# EAGLE schematic plugV13 (EAGLE 7.5.0)
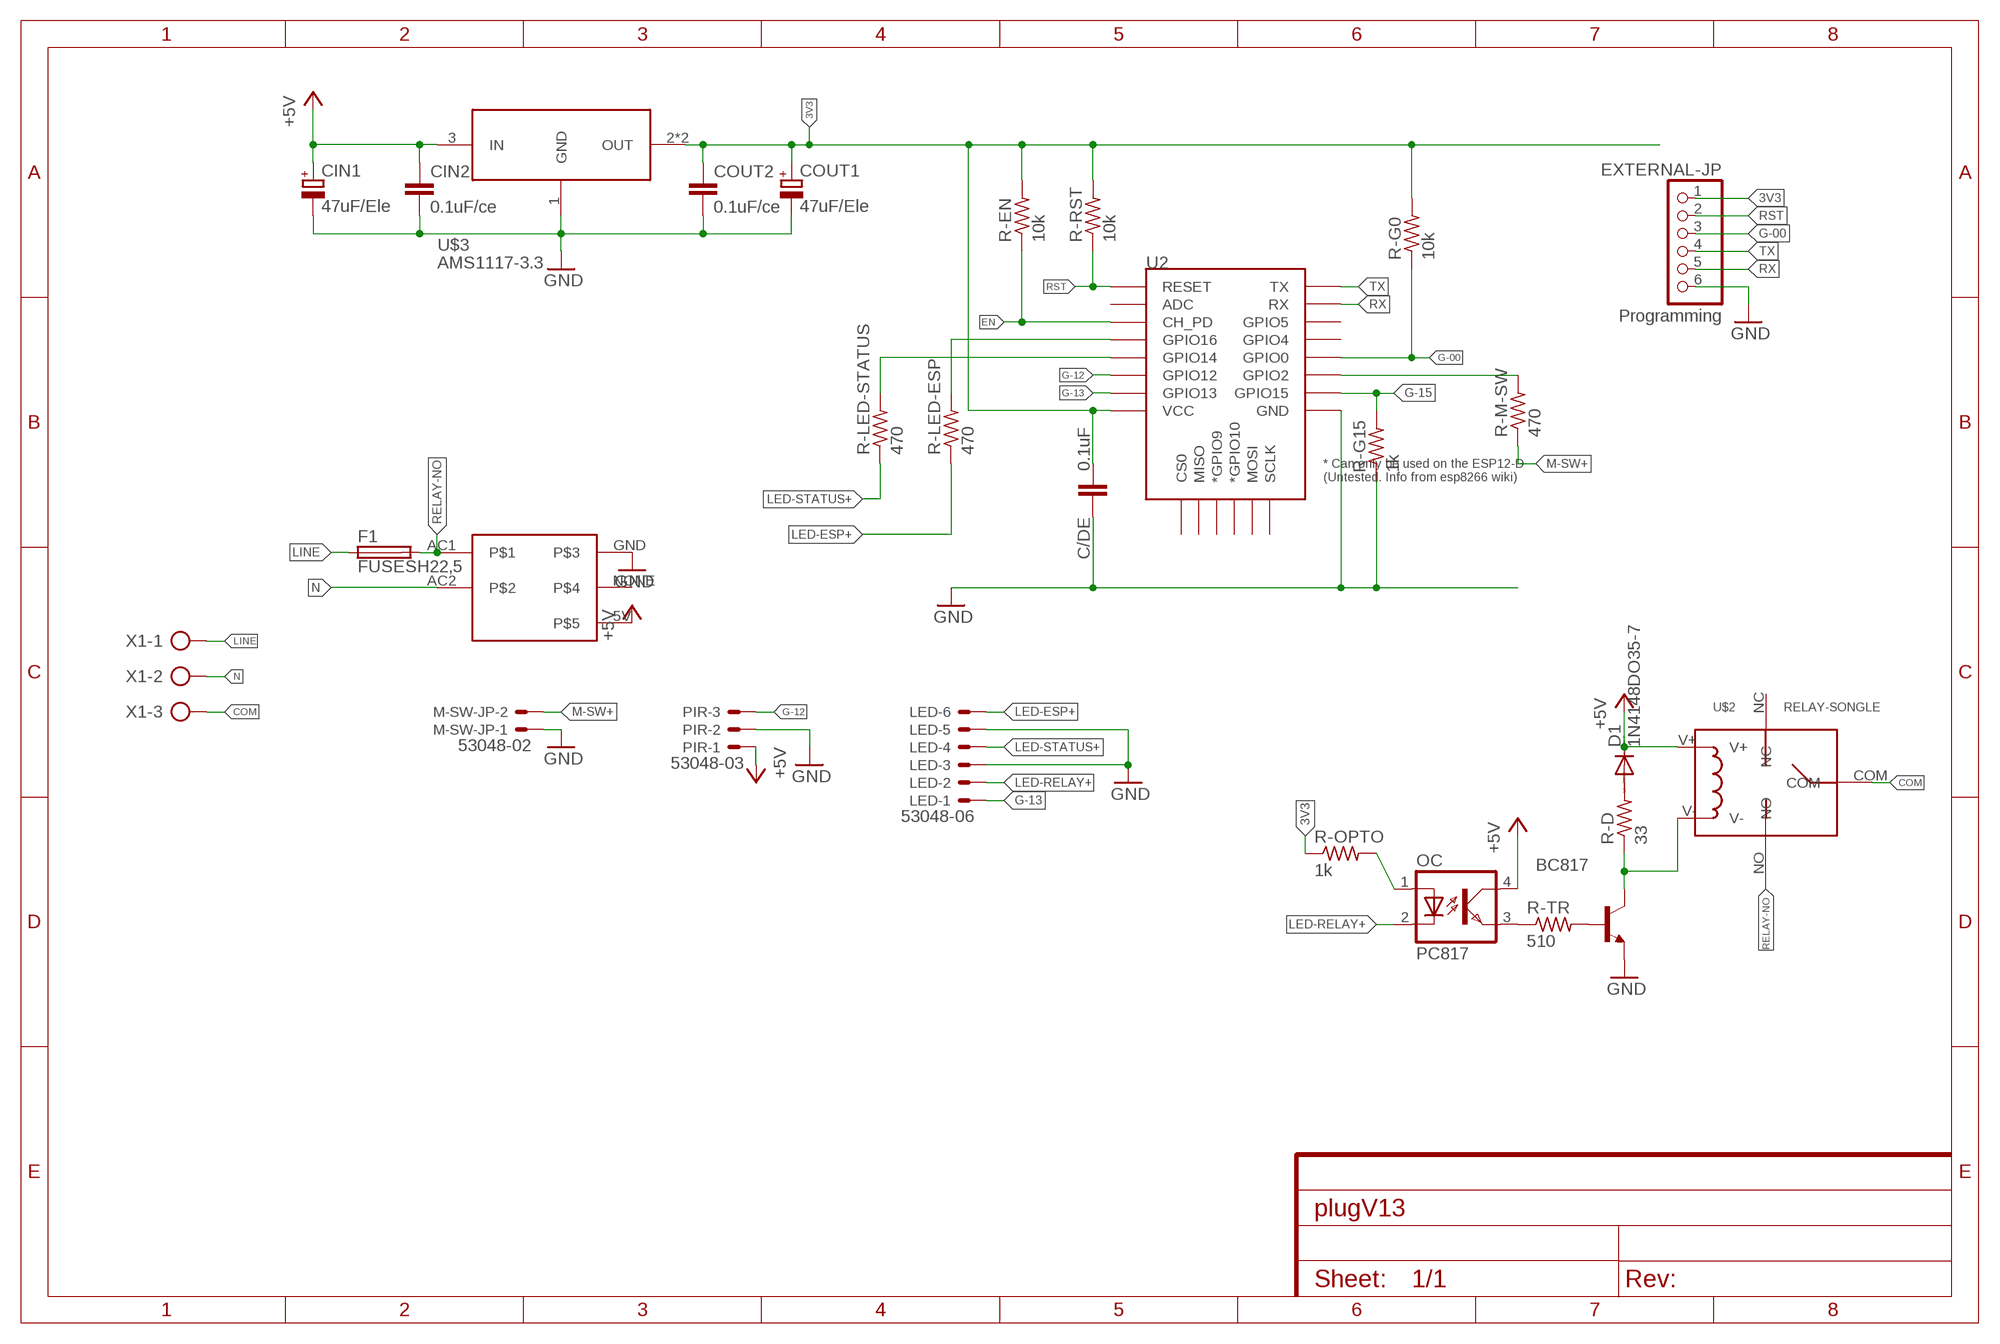
[diagram p0: schematic, sheet 1]

## Parts
BC817  BC817-NPN-SOT23-BEC  [SOT23-BEC]
C/DE  0.1uF  C-EUC0805  [C0805]
CIN1  47uF/Ele  CPOL-EUE2-5  [E2-5]
CIN2  0.1uF/ce  C-EUC0603K  [C0603K]
COUT1  47uF/Ele  CPOL-EUE2-5  [E2-5]
COUT2  0.1uF/ce  C-EUC0603K  [C0603K]
D1  1N4148DO35-7  [DO35-7]
EXTERNAL-JP  Programming  PINHD-1X6  [1X06]
F1  FUSESH22,5  [SH22,5]
LED  53048-06  [53048-06]
M-SW-JP  53048-02  [53048-02]
OC  PC817  [DIL04]
PIR  53048-03  [53048-03]
R-D  33  R-US_M0805  [M0805]
R-EN  10k  R-US_R0603  [R0603]
R-G0  10k  R-US_R0603  [R0603]
R-G15  1k  R-US_R0603  [R0603]
R-LED-ESP  470  R-US_R0603  [R0603]
R-LED-STATUS  470  R-US_R0603  [R0603]
R-M-SW  470  R-US_R0603  [R0603]
R-OPTO  1k  R-US_M0805  [M0805]
R-RST  10k  R-US_R0603  [R0603]
R-TR  510  R-US_M0805  [M0805]
U2  ESP12ESMD  [ESP12E-SMD]
U$2  RELAY-SONGLE  [RELAY-SONGLE]
U$3  AMS1117-3.3  [SOT-223]
U$4  POWERSUPPLY-5V-700MA  [POWERSUPPLY-5V-700MA]
X1  AK300/3  [AK300/3]

## Nets
3V3: C/DE.1 COUT1.+ COUT2.1 EXTERNAL-JP.1 R-EN.2 R-G0.2 R-OPTO.1 R-RST.2 U2.VCC U$3.2(OUT) U$3.4(OUT)
+5V: CIN1.+ CIN2.1 D1.C OC.4(COL) PIR.1 U$2.V+ U$3.3(IN) U$4.5V
COM: U$2.COM X1.3
EN: R-EN.1 U2.CH_PD
G-00: EXTERNAL-JP.3 R-G0.1 U2.GPIO0
G-12: PIR.3 U2.GPIO12
G-13: LED.1 U2.GPIO13
G-15: R-G15.2 U2.GPIO15
GND: BC817.E C/DE.2 CIN1.- CIN2.2 COUT1.- COUT2.2 EXTERNAL-JP.6 LED.3 LED.5 M-SW-JP.1 PIR.2 R-G15.1 U2.GND U$3.1(GND) U$4.GND
LED-ESP+: LED.6 R-LED-ESP.1
LED-RELAY+: LED.2 OC.2(C)
LED-STATUS+: LED.4 R-LED-STATUS.1
LINE: F1.1 X1.1
M-SW+: M-SW-JP.2 R-M-SW.1
N: U$4.AC2 X1.2
N$1: OC.3(EMIT) R-TR.1
N$2: BC817.B R-TR.2
N$4: R-LED-ESP.2 U2.GPIO16
N$7: R-M-SW.2 U2.GPIO2
N$8: R-LED-STATUS.2 U2.GPIO14
N$13: OC.1(A) R-OPTO.2
N$16: D1.A R-D.2
N$17: BC817.C R-D.1 U$2.V-
RELAY-NO: F1.2 U$2.NO U$4.AC1
RST: EXTERNAL-JP.2 R-RST.1 U2.RESET
RX: EXTERNAL-JP.5 U2.RXD0(RX)
TX: EXTERNAL-JP.4 U2.TXD0(TX)
Unconnected: U2.ADC U2.CS0 U2.GPIO4 U2.GPIO5 U2.GPIO9(*GPIO9) U2.GPIO10(*GPIO10) U2.MISO U2.MOSI U2.SCLK U$2.NC U$4.NONE

## Library data of the parts
BC817 = transistor-neu-to92:*-NPN-: NPN Transistror
C/DE CIN2 COUT2 = rcl:C-EU: CAPACITOR, European symbol
CIN1 COUT1 = rcl:CPOL-EU: POLARIZED CAPACITOR, European symbol
D1 = diode:1N4148: DIODE high speed (Philips)
EXTERNAL-JP = pinhead:PINHD-1X6: PIN HEADER
F1 = fuse:FUSE: Fuse; OC_FARNELL: unknown; OC_NEWARK: unknown
LED = con-molex:53?-06: CONNECTOR wire to board 1.25 mm (.049 inch) pitch header; MF: WALDOM/MOLEX; MPN: 53048-0610; OC_FARNELL: 1012260; OC_NEWARK: 38C9911
M-SW-JP = con-molex:53?-02: CONNECTOR wire to board 1.25 mm (.049 inch) pitch header; MF: MOLEX; MPN: 53048-0210; OC_FARNELL: 1012259; OC_NEWARK: 57H4718
OC = optocoupler:PC817: SHARP OPTO COUPLER; MPN: PC817X4J000F; OC_FARNELL: 9707727; OC_NEWARK: 97K7059
PIR = con-molex:53?-03: CONNECTOR wire to board 1.25 mm (.049 inch) pitch header; MF: WALDOM/MOLEX; MPN: 53048-0310; OC_FARNELL: 9732918; OC_NEWARK: 38C9908
R-D R-EN R-G0 R-G15 R-LED-ESP R-LED-STATUS R-M-SW R-OPTO R-RST R-TR = rcl:R-US_: RESISTOR, American symbol
U2 = esp8266modules:ESP12E: ESP12E Module
U$2 = Seeed-OPL-Relay:RELAY-SONGLE
U$3 = AMS1117-3.3:AMS1117-3.3: 1A LOW DROPOUT VOLTAGE REGULATOR
U$4 = PowerSupply-5V-700mA:POWERSUPPLY-5V-700MA
X1 = con-ptr500:AK300/3: CONNECTOR; OC_FARNELL: unknown; OC_NEWARK: unknown